# EAGLE board main_circuit (EAGLE 7.5.0), part 1 of 2
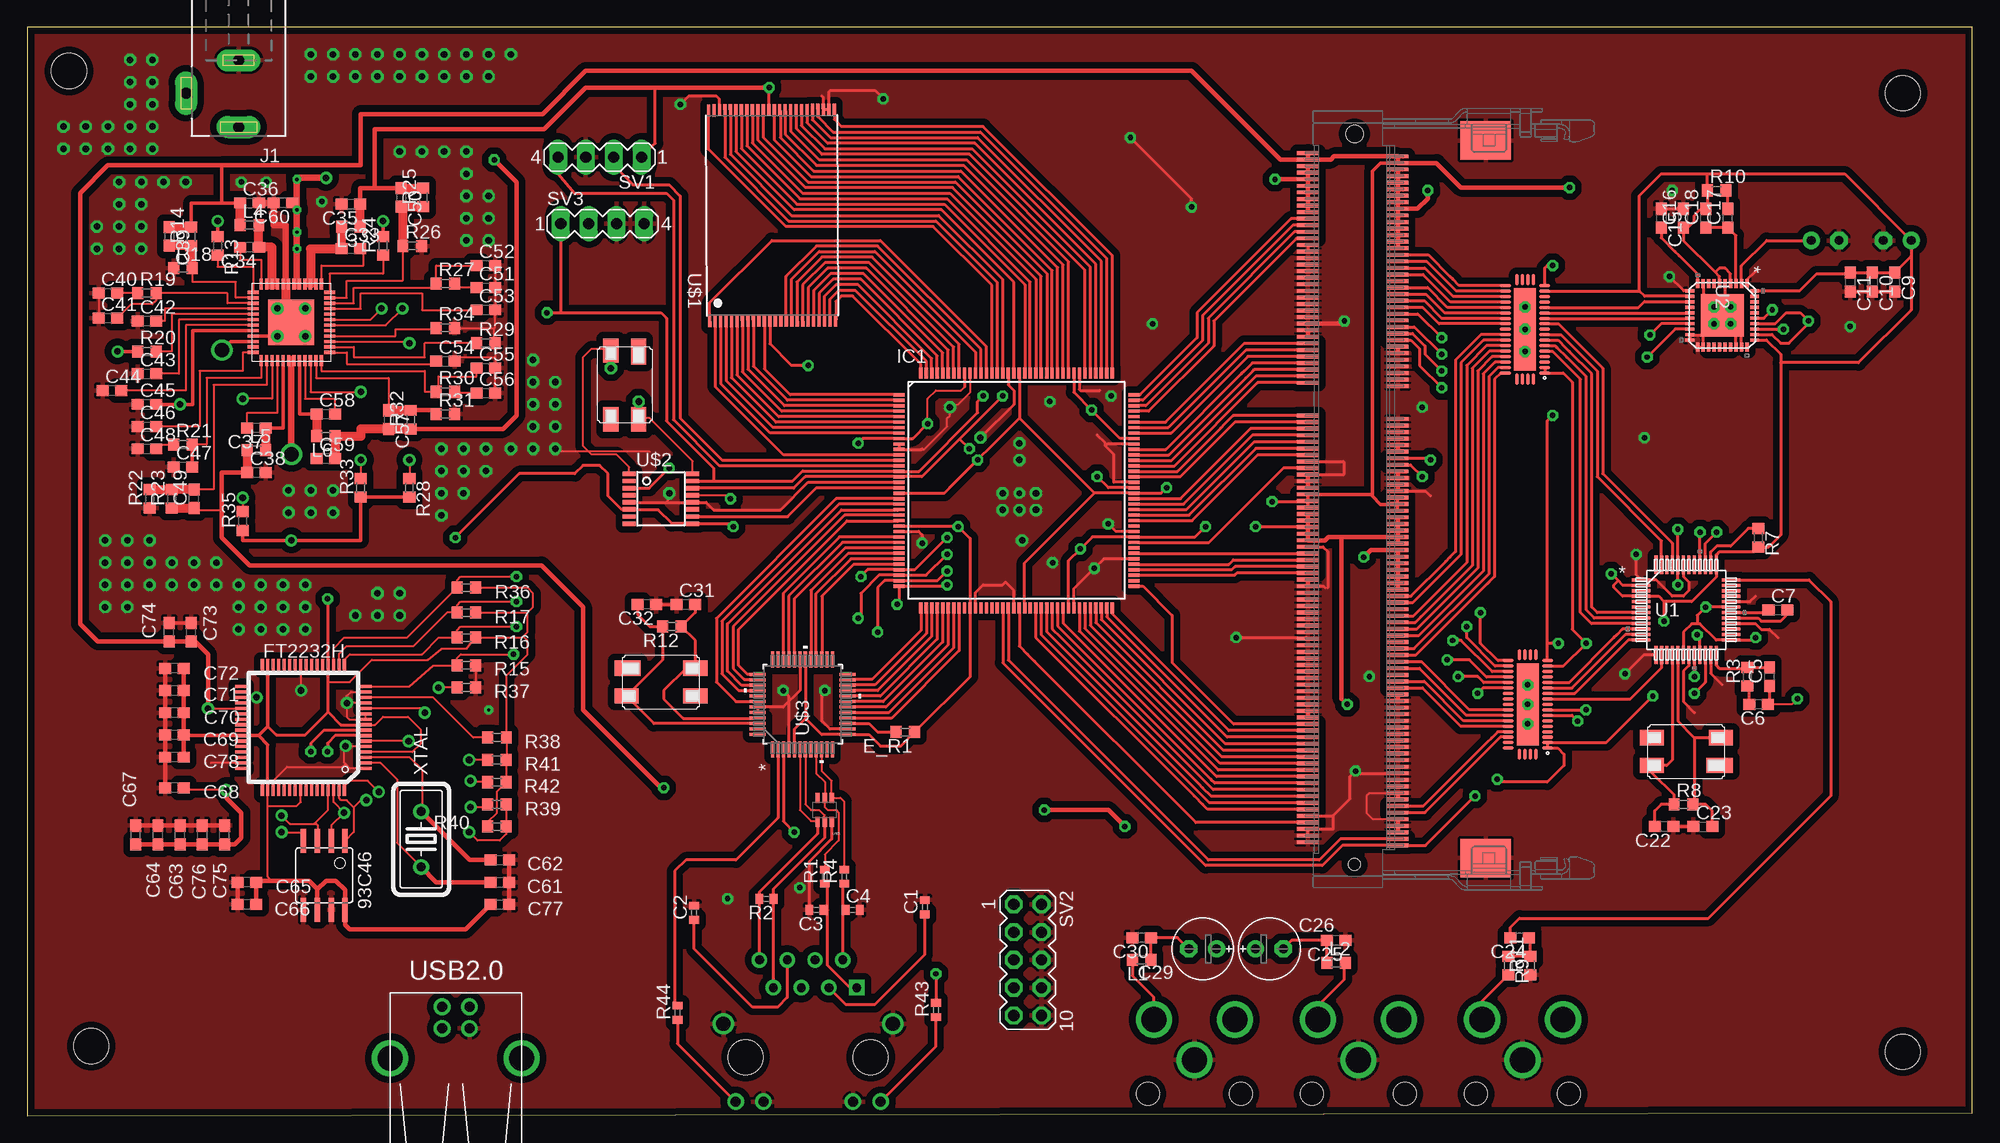
[diagram p5: board, top side]
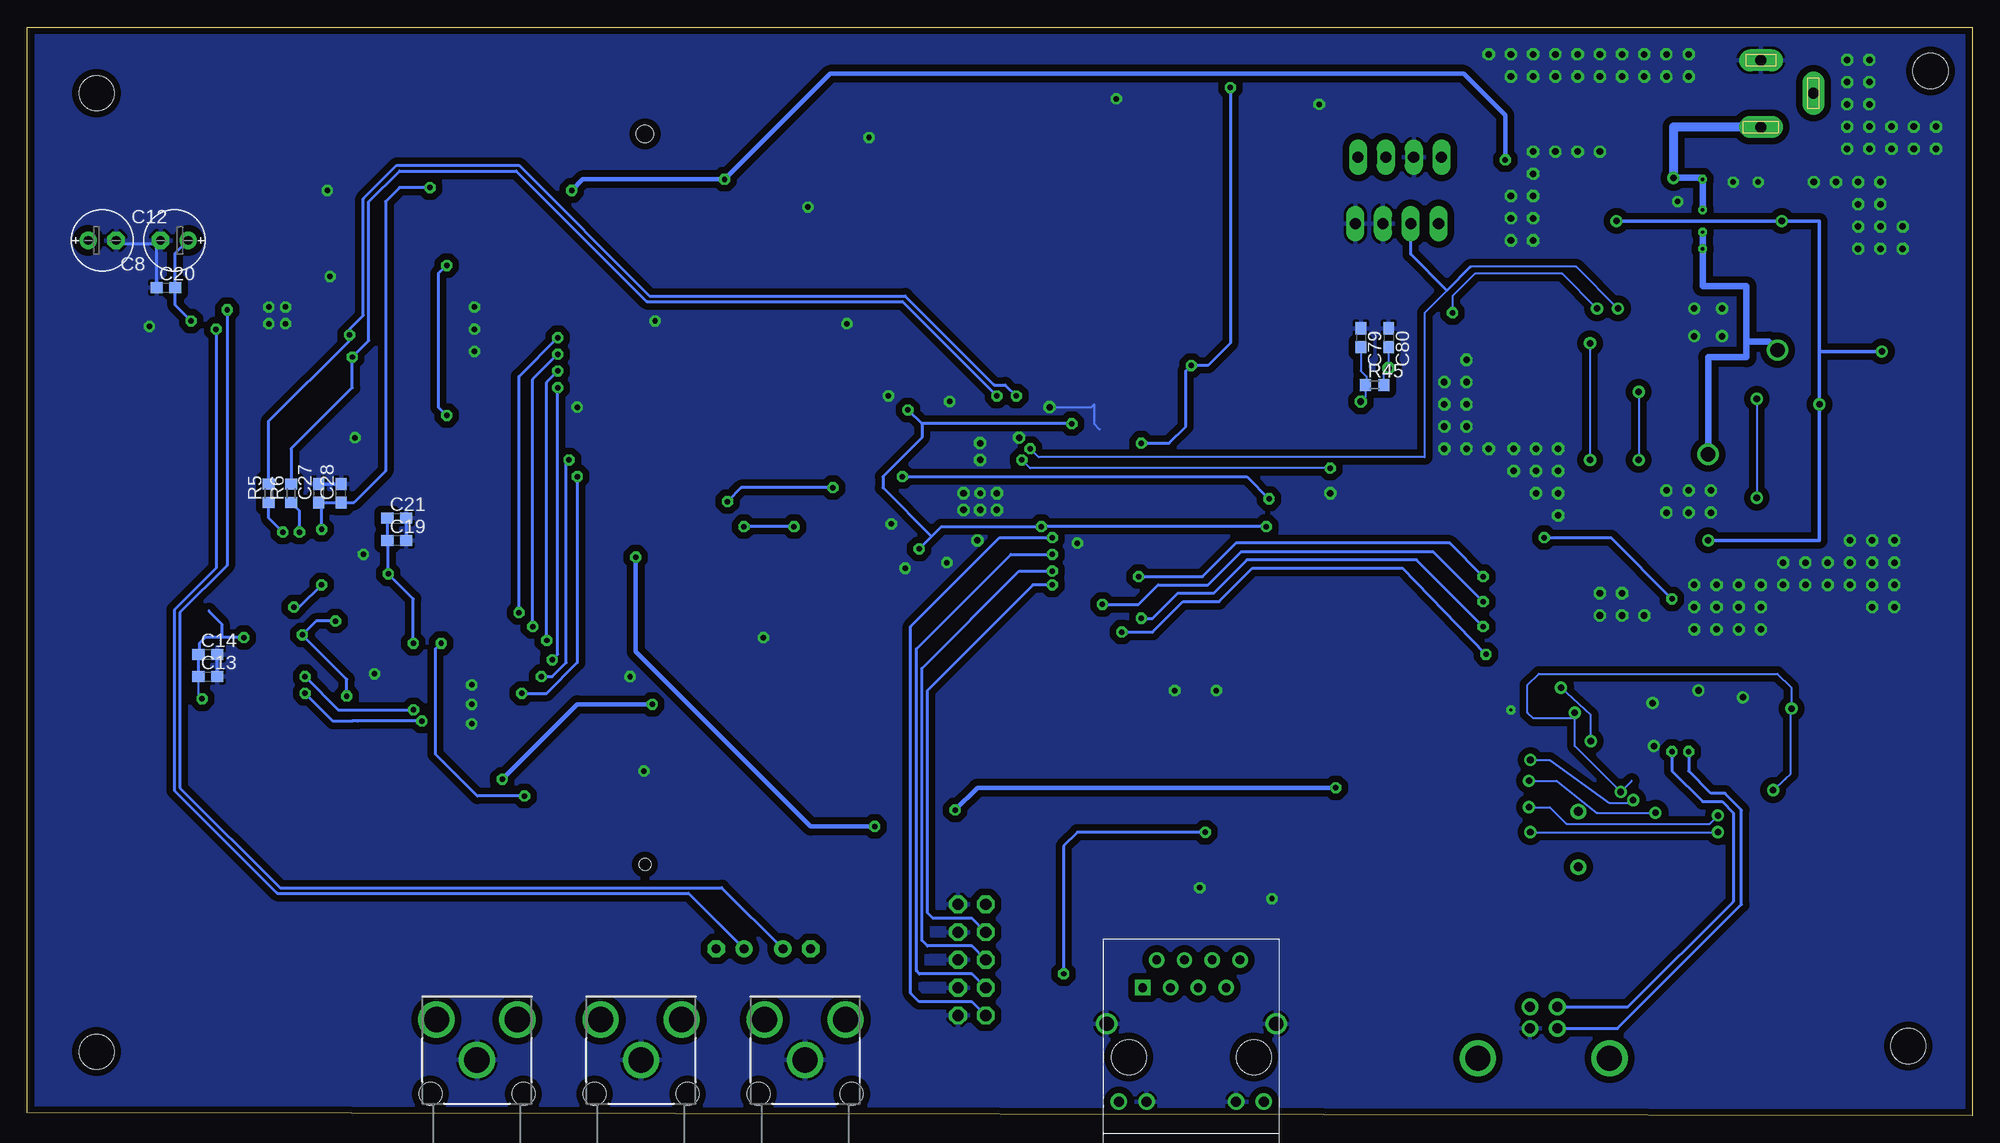
[diagram p6: board, bottom side, seen from below]

Size 177.78 x 99.49 mm. Coordinates in mm from the lower left corner, seen from the top.
Outline: 0,0 177.78,0.25 177.78,99.49 0,99.49 0,0
Copper layers (1*16): Top 0.035mm / dielectric 1.5mm / Bottom 0.035mm
Design rules "MayhewLabsPCB": minimum track width 6mil, minimum drill 12mil, track to track 6mil, track to pad 6mil, pad to pad 6mil, via to via 6mil, smd to smd 6mil, copper to edge 15mil, drill to drill 6mil, minimum pad ring 12mil, minimum via ring 10mil, stop-mask expansion 4mil, vias tented up to drill 25mil, thermal gap 10mil
Holes 3.2 mm at 3.81,95.5 5.84,6.35 171.45,5.84 171.45,93.47

## Footprints (pad centres in the part's own frame; a part is rotated, then mirrored left to right if it is on the bottom)
SOIC8 = smd 0.5 x 2.2: 1 -1.905,-3.154; 2 -0.645,-3.154; 3 0.625,-3.154; 4 1.895,-3.154; 5 1.905,3.154; 6 0.635,3.154; 7 -0.635,3.154; 8 -1.905,3.154
C0402 = smd 0.7 x 0.9: 1 -0.65,0; 2 0.65,0
C0603 = smd 1.1 x 1: 1 -0.85,0; 2 0.85,0
E2,5-6E = drill 0.813 pad 1.575: + -1.27,0 | drill 0.813 pad 1.575 octagon: - 1.27,0
R0603 = smd 1 x 1.1: 1 -0.85,0; 2 0.85,0
LQFP_NEW = smd 1.1 x 0.285: 1 -5.7,3.75; 2 -5.7,3.25; 3 -5.7,2.75; 4 -5.7,2.25; 5 -5.7,1.75; 6 -5.7,1.25; 7 -5.7,0.75; 8 -5.7,0.25; 9 -5.7,-0.25; 10 -5.7,-0.75; 11 -5.7,-1.25; 12 -5.7,-1.75; 13 -5.7,-2.25; 14 -5.7,-2.75; 15 -5.7,-3.25; 16 -5.7,-3.75; 33 5.7,-3.75; 34 5.7,-3.25; 35 5.7,-2.75; 36 5.7,-2.25; 37 5.7,-1.75; 38 5.7,-1.25; 39 5.7,-0.75; 40 5.7,-0.25; 41 5.7,0.25; 42 5.7,0.75; 43 5.7,1.25; 44 5.7,1.75; 45 5.7,2.25; 46 5.7,2.75; 47 5.7,3.25; 48 5.7,3.75 | smd 0.285 x 1.1: 17 -3.75,-5.7; 18 -3.25,-5.7; 19 -2.75,-5.7; 20 -2.25,-5.7; 21 -1.75,-5.7; 22 -1.25,-5.7; 23 -0.75,-5.7; 24 -0.25,-5.7; 25 0.25,-5.7; 26 0.75,-5.7; 27 1.25,-5.7; 28 1.75,-5.7; 29 2.25,-5.7; 30 2.75,-5.7; 31 3.25,-5.7; 32 3.75,-5.7; 49 3.75,5.7; 50 3.25,5.7; 51 2.75,5.7; 52 2.25,5.7; 53 1.75,5.7; 54 1.25,5.7; 55 0.75,5.7; 56 0.25,5.7; 57 -0.25,5.7; 58 -0.75,5.7; 59 -1.25,5.7; 60 -1.75,5.7; 61 -2.25,5.7; 62 -2.75,5.7; 63 -3.25,5.7; 64 -3.75,5.7
R-PWQFN-N42 = smd 7.5 x 2: GND@1 0,0 | smd 0.3 x 1: P$1 -4,-1.8; P$2 -3.5,-1.8; P$3 -3,-1.8; P$4 -2.5,-1.8; P$5 -2,-1.8; P$6 -1.5,-1.8; P$7 -1,-1.8; P$8 -0.5,-1.8; P$9 0,-1.8; P$10 0.5,-1.8; P$11 1,-1.8; P$12 1.5,-1.8; P$13 2,-1.8; P$14 2.5,-1.8; P$15 3,-1.8; P$16 3.5,-1.8; P$17 4,-1.8; P$22 4,1.8; P$23 3.5,1.8; P$24 3,1.8; P$25 2.5,1.8; P$26 2,1.8; P$27 1.5,1.8; P$28 1,1.8; P$29 0.5,1.8; P$30 0,1.8; P$31 -0.5,1.8; P$32 -1,1.8; P$33 -1.5,1.8; P$34 -2,1.8; P$35 -2.5,1.8; P$36 -3,1.8; P$37 -3.5,1.8; P$38 -4,1.8 | smd 1 x 0.3: P$18 4.55,-0.75; P$19 4.55,-0.25; P$20 4.55,0.25; P$21 4.55,0.75; P$39 -4.55,0.75; P$40 -4.55,0.25; P$41 -4.55,-0.25; P$42 -4.55,-0.75
TQFP144 = smd 1 x 0.3: 1 -10.75,8.75; 2 -10.75,8.25; 3 -10.75,7.75; 4 -10.75,7.25; 5 -10.75,6.75; 6 -10.75,6.25; 7 -10.75,5.75; 8 -10.75,5.25; 9 -10.75,4.75; 10 -10.75,4.25; 11 -10.75,3.75; 12 -10.75,3.25; 13 -10.75,2.75; 14 -10.75,2.25; 15 -10.75,1.75; 16 -10.75,1.25; 17 -10.75,0.75; 18 -10.75,0.25; 19 -10.75,-0.25; 20 -10.75,-0.75; 21 -10.75,-1.25; 22 -10.75,-1.75; 23 -10.75,-2.25; 24 -10.75,-2.75; 25 -10.75,-3.25; 26 -10.75,-3.75; 27 -10.75,-4.25; 28 -10.75,-4.75; 29 -10.75,-5.25; 30 -10.75,-5.75; 31 -10.75,-6.25; 32 -10.75,-6.75; 33 -10.75,-7.25; 34 -10.75,-7.75; 35 -10.75,-8.25; 36 -10.75,-8.75; 73 10.75,-8.75; 74 10.75,-8.25; 75 10.75,-7.75; 76 10.75,-7.25; 77 10.75,-6.75; 78 10.75,-6.25; 79 10.75,-5.75; 80 10.75,-5.25; 81 10.75,-4.75; 82 10.75,-4.25; 83 10.75,-3.75; 84 10.75,-3.25; 85 10.75,-2.75; 86 10.75,-2.25; 87 10.75,-1.75; 88 10.75,-1.25; 89 10.75,-0.75; 90 10.75,-0.25; 91 10.75,0.25; 92 10.75,0.75; 93 10.75,1.25; 94 10.75,1.75; 95 10.75,2.25; 96 10.75,2.75; 97 10.75,3.25; 98 10.75,3.75; 99 10.75,4.25; 100 10.75,4.75; 101 10.75,5.25; 102 10.75,5.75; 103 10.75,6.25; 104 10.75,6.75; 105 10.75,7.25; 106 10.75,7.75; 107 10.75,8.25; 108 10.75,8.75 | smd 0.3 x 1: 37 -8.75,-10.75; 38 -8.25,-10.75; 39 -7.75,-10.75; 40 -7.25,-10.75; 41 -6.75,-10.75; 42 -6.25,-10.75; 43 -5.75,-10.75; 44 -5.25,-10.75; 45 -4.75,-10.75; 46 -4.25,-10.75; 47 -3.75,-10.75; 48 -3.25,-10.75; 49 -2.75,-10.75; 50 -2.25,-10.75; 51 -1.75,-10.75; 52 -1.25,-10.75; 53 -0.75,-10.75; 54 -0.25,-10.75; 55 0.25,-10.75; 56 0.75,-10.75; 57 1.25,-10.75; 58 1.75,-10.75; 59 2.25,-10.75; 60 2.75,-10.75; 61 3.25,-10.75; 62 3.75,-10.75; 63 4.25,-10.75; 64 4.75,-10.75; 65 5.25,-10.75; 66 5.75,-10.75; 67 6.25,-10.75; 68 6.75,-10.75; 69 7.25,-10.75; 70 7.75,-10.75; 71 8.25,-10.75; 72 8.75,-10.75; 109 8.75,10.75; 110 8.25,10.75; 111 7.75,10.75; 112 7.25,10.75; 113 6.75,10.75; 114 6.25,10.75; 115 5.75,10.75; 116 5.25,10.75; 117 4.75,10.75; 118 4.25,10.75; 119 3.75,10.75; 120 3.25,10.75; 121 2.75,10.75; 122 2.25,10.75; 123 1.75,10.75; 124 1.25,10.75; 125 0.75,10.75; 126 0.25,10.75; 127 -0.25,10.75; 128 -0.75,10.75; 129 -1.25,10.75; 130 -1.75,10.75; 131 -2.25,10.75; 132 -2.75,10.75; 133 -3.25,10.75; 134 -3.75,10.75; 135 -4.25,10.75; 136 -4.75,10.75; 137 -5.25,10.75; 138 -5.75,10.75; 139 -6.25,10.75; 140 -6.75,10.75; 141 -7.25,10.75; 142 -7.75,10.75; 143 -8.25,10.75; 144 -8.75,10.75
DCJ0202 = drill 1 pad 2 long: 1 0,3.1; 2 4.8,0; 3 0,-3
R0402 = smd 0.7 x 0.9: 1 -0.65,0; 2 0.65,0
MA04-1 = drill 1.016 long: 1 -3.81,0; 2 -1.27,0; 3 1.27,0; 4 3.81,0
MA05-2 = drill 1.016 octagon: 1 -5.08,-1.27; 2 -5.08,1.27; 3 -2.54,-1.27; 4 -2.54,1.27; 5 0,-1.27; 6 0,1.27; 7 2.54,-1.27; 8 2.54,1.27; 9 5.08,-1.27; 10 5.08,1.27
ST_48 = smd 1.676 x 0.279: 1 -4.115,2.75; 2 -4.115,2.25; 3 -4.115,1.75; 4 -4.115,1.25; 5 -4.115,0.75; 6 -4.115,0.25; 7 -4.115,-0.25; 8 -4.115,-0.75; 9 -4.115,-1.25; 10 -4.115,-1.75; 11 -4.115,-2.25; 12 -4.115,-2.75; 25 4.115,-2.75; 26 4.115,-2.25; 27 4.115,-1.75; 28 4.115,-1.25; 29 4.115,-0.75; 30 4.115,-0.25; 31 4.115,0.25; 32 4.115,0.75; 33 4.115,1.25; 34 4.115,1.75; 35 4.115,2.25; 36 4.115,2.75 | smd 0.279 x 1.676: 13 -2.75,-4.115; 14 -2.25,-4.115; 15 -1.75,-4.115; 16 -1.25,-4.115; 17 -0.75,-4.115; 18 -0.25,-4.115; 19 0.25,-4.115; 20 0.75,-4.115; 21 1.25,-4.115; 22 1.75,-4.115; 23 2.25,-4.115; 24 2.75,-4.115; 37 2.75,4.115; 38 2.25,4.115; 39 1.75,4.115; 40 1.25,4.115; 41 0.75,4.115; 42 0.25,4.115; 43 -0.25,4.115; 44 -0.75,4.115; 45 -1.25,4.115; 46 -1.75,4.115; 47 -2.25,4.115; 48 -2.75,4.115
CP_40_14 = smd 0.813 x 0.305: 1 -2.902,2.25; 2 -2.902,1.75; 3 -2.902,1.25; 4 -2.902,0.75; 5 -2.902,0.25; 6 -2.902,-0.25; 7 -2.902,-0.75; 8 -2.902,-1.25; 9 -2.902,-1.75; 10 -2.902,-2.25; 21 2.902,-2.25; 22 2.902,-1.75; 23 2.902,-1.25; 24 2.902,-0.75; 25 2.902,-0.25; 26 2.902,0.25; 27 2.902,0.75; 28 2.902,1.25; 29 2.902,1.75; 30 2.902,2.25 | smd 0.305 x 0.813: 11 -2.25,-2.95; 12 -1.75,-2.95; 13 -1.25,-2.95; 14 -0.75,-2.95; 15 -0.25,-2.95; 16 0.25,-2.95; 17 0.75,-2.95; 18 1.25,-2.95; 19 1.75,-2.95; 20 2.25,-2.95; 31 2.25,2.95; 32 1.75,2.95; 33 1.25,2.95; 34 0.75,2.95; 35 0.25,2.95; 36 -0.25,2.95; 37 -0.75,2.95; 38 -1.25,2.95; 39 -1.75,2.95; 40 -2.25,2.95 | smd 3.912 x 3.912: 41 0,0
TSOP48 = smd 1.1 x 0.3: 1 -9.625,5.75; 2 -9.625,5.25; 3 -9.625,4.75; 4 -9.625,4.25; 5 -9.625,3.75; 6 -9.625,3.25; 7 -9.625,2.75; 8 -9.625,2.25; 9 -9.625,1.75; 10 -9.625,1.25; 11 -9.625,0.75; 12 -9.625,0.25; 13 -9.625,-0.25; 14 -9.625,-0.75; 15 -9.625,-1.25; 16 -9.625,-1.75; 17 -9.625,-2.25; 18 -9.625,-2.75; 19 -9.625,-3.25; 20 -9.625,-3.75; 21 -9.625,-4.25; 22 -9.625,-4.75; 23 -9.625,-5.25; 24 -9.625,-5.75; 25 9.625,-5.75; 26 9.625,-5.25; 27 9.625,-4.75; 28 9.625,-4.25; 29 9.625,-3.75; 30 9.625,-3.25; 31 9.625,-2.75; 32 9.625,-2.25; 33 9.625,-1.75; 34 9.625,-1.25; 35 9.625,-0.75; 36 9.625,-0.25; 37 9.625,0.25; 38 9.625,0.75; 39 9.625,1.25; 40 9.625,1.75; 41 9.625,2.25; 42 9.625,2.75; 43 9.625,3.25; 44 9.625,3.75; 45 9.625,4.25; 46 9.625,4.75; 47 9.625,5.25; 48 9.625,5.75
R-PDSO-G16 = smd 0.4 x 1.2: 1 -2.275,-2.9; 2 -1.625,-2.9; 3 -0.975,-2.9; 4 -0.325,-2.9; 5 0.325,-2.9; 6 0.975,-2.9; 7 1.625,-2.9; 8 2.275,-2.9; 9 2.275,2.9; 10 1.625,2.9; 11 0.975,2.9; 12 0.325,2.9; 13 -0.325,2.9; 14 -0.975,2.9; 15 -1.625,2.9; 16 -2.275,2.9
QFP48-7X7-0P5MM = smd 1.473 x 0.279: 1 -4.115,2.75; 2 -4.115,2.25; 3 -4.115,1.75; 4 -4.115,1.25; 5 -4.115,0.75; 6 -4.115,0.25; 7 -4.115,-0.25; 8 -4.115,-0.75; 9 -4.115,-1.25; 10 -4.115,-1.75; 11 -4.115,-2.25; 12 -4.115,-2.75; 25 4.115,-2.75; 26 4.115,-2.25; 27 4.115,-1.75; 28 4.115,-1.25; 29 4.115,-0.75; 30 4.115,-0.25; 31 4.115,0.25; 32 4.115,0.75; 33 4.115,1.25; 34 4.115,1.75; 35 4.115,2.25; 36 4.115,2.75 | smd 0.279 x 1.473: 13 -2.75,-4.115; 14 -2.25,-4.115; 15 -1.75,-4.115; 16 -1.25,-4.115; 17 -0.75,-4.115; 18 -0.25,-4.115; 19 0.25,-4.115; 20 0.75,-4.115; 21 1.25,-4.115; 22 1.75,-4.115; 23 2.25,-4.115; 24 2.75,-4.115; 37 2.75,4.115; 38 2.25,4.115; 39 1.75,4.115; 40 1.25,4.115; 41 0.75,4.115; 42 0.25,4.115; 43 -0.25,4.115; 44 -0.75,4.115; 45 -1.25,4.115; 46 -1.75,4.115; 47 -2.25,4.115; 48 -2.75,4.115
SODIMM_DDR3_CONN = smd 0.35 x 2: 1 26.018,4.348; 2 25.719,-3.855; 3 25.419,4.345; 4 25.119,-3.855; 5 24.819,4.345; 6 24.519,-3.855; 7 24.219,4.345; 8 23.919,-3.855; 9 23.619,4.345; 10 23.319,-3.855; 11 23.019,4.345; 12 22.719,-3.855; 13 22.419,4.345; 14 22.119,-3.855; 15 21.819,4.345; 16 21.519,-3.855; 17 21.219,4.345; 18 20.919,-3.855; 19 20.619,4.345; 20 20.319,-3.855; 21 20.019,4.345; 22 19.719,-3.855; 23 19.419,4.345; 24 19.119,-3.855; 25 18.819,4.345; 26 18.519,-3.855; 27 18.219,4.345; 28 17.919,-3.855; 29 17.619,4.345; 30 17.319,-3.855; 31 17.019,4.345; 32 16.719,-3.855; 33 16.419,4.345; 34 16.119,-3.855; 35 15.819,4.345; 36 15.519,-3.855; 37 15.219,4.345; 38 14.919,-3.855; 39 14.619,4.345; 40 14.319,-3.855; 41 14.019,4.345; 42 13.719,-3.855; 43 13.419,4.345; 44 13.119,-3.855; 45 12.819,4.345; 46 12.519,-3.855; 47 12.219,4.345; 48 11.919,-3.855; 49 11.619,4.345; 50 11.319,-3.855; 51 11.019,4.345; 52 10.719,-3.855; 53 10.419,4.345; 54 10.119,-3.855; 55 9.819,4.345; 56 9.519,-3.855; 57 9.219,4.345; 58 8.919,-3.855; 59 8.619,4.345; 60 8.319,-3.855; 61 8.019,4.345; 62 7.719,-3.855; 63 7.419,4.345; 64 7.119,-3.855; 65 6.819,4.345; 66 6.519,-3.855; 67 6.219,4.345; 68 5.919,-3.855; 69 5.619,4.345; 70 5.319,-3.855; 71 5.019,4.345; 72 4.719,-3.855; 73 2.019,4.345; 74 1.719,-3.855; 75 1.419,4.345; 76 1.119,-3.855; 77 0.819,4.345; 78 0.519,-3.855; 79 0.219,4.345; 80 -0.081,-3.855; 81 -0.381,4.345; 82 -0.681,-3.855; 83 -0.981,4.345; 84 -1.281,-3.855; 85 -1.581,4.345; 86 -1.881,-3.855; 87 -2.181,4.345; 88 -2.481,-3.855; 89 -2.781,4.345; 90 -3.081,-3.855; 91 -3.381,4.345; 92 -3.681,-3.855; 93 -3.981,4.345; 94 -4.281,-3.855; 95 -4.581,4.345; 96 -4.881,-3.855; 97 -5.181,4.345; 98 -5.481,-3.855; 99 -5.781,4.345; 100 -6.081,-3.855; 101 -6.381,4.345; 102 -6.681,-3.855; 103 -6.981,4.345; 104 -7.281,-3.855; 105 -7.581,4.345; 106 -7.881,-3.855; 107 -8.181,4.345; 108 -8.481,-3.855; 109 -8.781,4.345; 110 -9.081,-3.855; 111 -9.381,4.345; 112 -9.681,-3.855; 113 -9.981,4.345; 114 -10.281,-3.855; 115 -10.581,4.345; 116 -10.881,-3.855; 117 -11.181,4.345; 118 -11.481,-3.855; 119 -11.781,4.345; 120 -12.081,-3.855; 121 -12.381,4.345; 122 -12.681,-3.855; 123 -12.981,4.345; 124 -13.281,-3.855; 125 -13.581,4.345; 126 -13.881,-3.855; 127 -14.181,4.345; 128 -14.481,-3.855; 129 -14.781,4.345; 130 -15.081,-3.855; 131 -15.381,4.345; 132 -15.681,-3.855; 133 -15.981,4.345; 134 -16.281,-3.855; 135 -16.581,4.345; 136 -16.881,-3.855; 137 -17.181,4.345; 138 -17.481,-3.855; 139 -17.781,4.345; 140 -18.081,-3.855; 141 -18.381,4.345; 142 -18.681,-3.855; 143 -18.981,4.345; 144 -19.281,-3.855; 145 -19.581,4.345; 146 -19.881,-3.855; 147 -20.181,4.345; 148 -20.481,-3.855; 149 -20.781,4.345; 150 -21.081,-3.855; 151 -21.381,4.345; 152 -21.681,-3.855; 153 -21.981,4.345; 154 -22.281,-3.855; 155 -22.581,4.345; 156 -22.881,-3.855; 157 -23.181,4.345; 158 -23.481,-3.855; 159 -23.781,4.345; 160 -24.081,-3.855; 161 -24.381,4.345; 162 -24.681,-3.855; 163 -24.981,4.345; 164 -25.281,-3.855; 165 -25.581,4.345; 166 -25.881,-3.855; 167 -26.181,4.345; 168 -26.481,-3.855; 169 -26.781,4.345; 170 -27.081,-3.855; 171 -27.381,4.345; 172 -27.681,-3.855; 173 -27.981,4.345; 174 -28.281,-3.855; 175 -28.581,4.345; 176 -28.881,-3.855; 177 -29.181,4.345; 178 -29.481,-3.855; 179 -29.781,4.345; 180 -30.081,-3.855; 181 -30.381,4.345; 182 -30.681,-3.855; 183 -30.981,4.345; 184 -31.281,-3.855; 185 -31.581,4.345; 186 -31.881,-3.855; 187 -32.181,4.345; 188 -32.481,-3.855; 189 -32.781,4.345; 190 -33.081,-3.855; 191 -33.381,4.345; 192 -33.681,-3.855; 193 -33.981,4.345; 194 -34.281,-3.855; 195 -34.581,4.345; 196 -34.881,-3.855; 197 -35.181,4.345; 198 -35.481,-3.855; 199 -35.781,4.345; 200 -36.081,-3.855; 201 -36.381,4.345; 202 -36.681,-3.855; 203 -36.981,4.345; 204 -37.281,-3.855 | smd 3.5 x 4.6: GND_PAD1 27.17,-11.9; GND_PAD2 -38.43,-11.9 | hole 1.6: 27.772,0.093 | hole 1.1: -39.028,0.093
SC70-6 = smd 0.4 x 0.9: 1 -0.665,-1.097; 2 -0.015,-1.096; 3 0.635,-1.097; 4 0.635,1.103; 5 -0.015,1.104; 6 -0.665,1.103
MAGJACK = drill 0.8 square: 1 -4.445,6.35 | drill 0.8: 2 -3.175,8.89; 3 -1.905,6.35; 4 -0.635,8.89; 5 0.635,6.35; 6 1.905,8.89; 7 3.175,6.35; 8 4.445,8.89 | drill 1.3: GND1 -7.747,3.048; GND2 7.747,3.048 | drill 0.9: LED1.1 -6.629,-4.064; LED1.2 -4.089,-4.064; LED2.1 4.089,-4.064; LED2.2 6.629,-4.064 | hole 3.2: -5.715,0; 5.715,0
AV3RCA = drill 2.3: PIN -0.11,-7.51; PIN1 14.89,-7.51; PIN2 29.89,-7.51; SHELL -3.81,-3.81; SHELL1 11.19,-3.81; SHELL2 26.19,-3.81; SWITCH -7.51,-7.51; SWITCH1 7.49,-7.51; SWITCH2 22.49,-7.51 | hole 2.1: 0.44,-0.71; -8.06,-0.71; 15.44,-0.71; 6.94,-0.71; 30.44,-0.71; 21.94,-0.71
VQFN48 = smd 4.2 x 4.2: 0 0,0 | smd 1 x 0.3: 1 -3.5,2.75; 2 -3.5,2.25; 3 -3.5,1.75; 4 -3.5,1.25; 5 -3.5,0.75; 6 -3.5,0.25; 7 -3.5,-0.25; 8 -3.5,-0.75; 9 -3.5,-1.25; 10 -3.5,-1.75; 11 -3.5,-2.25; 12 -3.5,-2.75; 25 3.5,-2.75; 26 3.5,-2.25; 27 3.5,-1.75; 28 3.5,-1.25; 29 3.5,-0.75; 30 3.5,-0.25; 31 3.5,0.25; 32 3.5,0.75; 33 3.5,1.25; 34 3.5,1.75; 35 3.5,2.25; 36 3.5,2.75 | smd 0.3 x 1: 13 -2.75,-3.5; 14 -2.25,-3.5; 15 -1.75,-3.5; 16 -1.25,-3.5; 17 -0.75,-3.5; 18 -0.25,-3.5; 19 0.25,-3.5; 20 0.75,-3.5; 21 1.25,-3.5; 22 1.75,-3.5; 23 2.25,-3.5; 24 2.75,-3.5; 37 2.75,3.5; 38 2.25,3.5; 39 1.75,3.5; 40 1.25,3.5; 41 0.75,3.5; 42 0.25,3.5; 43 -0.25,3.5; 44 -0.75,3.5; 45 -1.25,3.5; 46 -1.75,3.5; 47 -2.25,3.5; 48 -2.75,3.5
USB-B-H = drill 0.914: D+ 0,1.25; D- 1.981,1.25; GND 0,-1.25; VBUS 1.981,-1.25 | drill 2.286: P$1 -2.718,-6.02; P$2 -2.718,6.02
HC18U-V = drill 0.813: 1 -2.54,0; 2 2.54,0
7X5MM = smd 2.2 x 1.4: 1 -3.15,-1.27; 2 -3.15,1.27; 3 3.15,1.27 | smd 2.4 x 1.4: 4 3.05,-1.27

## Placement (x,y rotation side)
93C46  [SOIC8]  27.14,21.97 180 top
C1  0.1uF  [C0402]  82.04,19.05 90 top
C2  0.1uF  [C0402]  60.96,18.54 90 top
C3  0.001uF  [C0402]  72.14,18.8 180 top
C4  0.001uF  [C0402]  75.44,18.8 0 top
C5  10nF  [C0603]  159.26,40.13 90 top
C6  82nF  [C0603]  158.24,37.59 180 top
C7  0.1uF  [C0603]  160.02,46.23 0 top
C8  10uF  [E2,5-6E]  164.34,80.01 180 bottom
C9  0.1uF  [C0603]  170.69,76.2 270 top
C10  0.1uF  [C0603]  168.66,76.2 270 top
C11  0.1uF  [C0603]  166.62,76.2 270 top
C12  10uF  [E2,5-6E]  170.94,80.01 0 bottom
C13  0.1uF  [C0603]  161.29,40.13 0 bottom
C14  10nF  [C0603]  161.29,42.16 0 bottom
C15  0.1uF  [C0603]  149.35,82.04 270 top
C16  0.1uF  [C0603]  151.38,82.04 90 top
C17  CALCU  [C0603]  155.45,82.04 90 top
C18  CALCU  [C0603]  153.42,82.04 90 top
C19  0.1uF  [C0603]  144.02,52.58 0 bottom
C20  0.1uF  [C0603]  165.1,75.69 0 bottom
C21  10nF  [C0603]  144.02,54.61 0 bottom
C22  47pf  [C0603]  149.61,26.42 180 top
C23  47pf  [C0603]  153.16,26.42 0 top
C24  0.1uF  [C0603]  136.4,16.26 180 top
C25  0.1uF  [C0603]  119.63,16 180 top
C26  10uF  [E2,5-6E]  113.54,15.24 0 top
C27  0.1uF  [C0603]  151.13,56.9 90 bottom
C28  10nF  [C0603]  149.1,56.9 90 bottom
C29  10uF  [E2,5-6E]  107.44,15.24 180 top
C30  0.1uF  [C0603]  101.85,16.26 180 top
C31  47pf  [C0603]  60.2,46.74 0 top
C32  47pf  [C0603]  56.64,46.74 180 top
C33  [C0603]  29.59,79.25 0 top
C34  [C0603]  20.32,79.38 180 top
C35  [C0603]  29.59,83.31 180 top
C36  [C0603]  20.32,83.44 0 top
C37  [C0603]  20.96,62.87 180 top
C38  [C0603]  20.96,58.8 0 top
C39  [C0603]  12.95,80.39 270 top
C40  [C0603]  7.37,75.18 0 top
C41  [C0603]  7.37,72.9 0 top
C42  [C0603]  10.92,72.64 0 top
C43  10 uF  [C0603]  10.92,67.82 0 top
C44  4.7 uF  [C0603]  7.75,66.29 0 top
C45  3.3 uF  [C0603]  10.92,65.02 0 top
C46  [C0603]  10.92,62.99 0 top
C47  [C0603]  14.22,59.31 0 top
C48  [C0603]  10.92,60.96 0 top
C49  [C0603]  15.24,56.39 90 top
C50  [C0603]  34.16,83.95 270 top
C51  [C0603]  41.91,75.69 0 top
C52  [C0603]  41.91,77.72 0 top
C53  [C0603]  41.91,73.66 0 top
C54  [C0603]  38.23,68.96 0 top
C55  [C0603]  41.91,68.33 0 top
C56  [C0603]  41.91,66.04 0 top
C57  [C0603]  33.02,63.63 270 top
C58  [C0603]  27.3,64.14 0 top
C59  [C0603]  27.3,60.07 0 top
C60  [C0603]  23.37,83.44 180 top
C61  27pf  [C0603]  43.18,21.34 0 top
C62  27pf  [C0603]  43.18,23.37 0 top
C63  3.3uf  [C0603]  13.97,25.65 90 top
C64  3.3uf  [C0603]  11.94,25.65 90 top
C65  4.7uf  [C0603]  20.07,21.34 180 top
C66  4.7uf  [C0603]  20.07,19.3 180 top
C67  4.7uf  [C0603]  9.91,25.65 90 top
C68  4.7uf  [C0603]  13.46,29.97 180 top
C69  100nf  [C0603]  13.46,34.8 180 top
C70  100nf  [C0603]  13.46,36.83 180 top
C71  100nf  [C0603]  13.46,38.86 180 top
C72  100nf  [C0603]  13.46,40.89 180 top
C73  100nf  [C0603]  14.99,44.2 90 top
C74  100nf  [C0603]  12.95,44.2 90 top
C75  100nf  [C0603]  18.03,25.65 90 top
C76  100nf  [C0603]  16,25.65 90 top
C77  3.3uf  [C0603]  43.18,19.3 0 top
C78  3.3uf  [C0603]  13.46,32.77 180 top
C79  47pf  [C0603]  55.88,71.12 270 bottom
C80  47pf  [C0603]  53.34,71.12 270 bottom
E_R1  4.7k  [R0603]  80.26,35.05 180 top
FT2232H  FT2232H  [LQFP_NEW]  25.24,35.48 180 top
GND  TS3DV642  [R-PWQFN-N42]  136.91,71.88 90 top
IC1  5M1270ZT144  [TQFP144]  90.42,57.15 0 top
J1  DCJ0202  [DCJ0202]  19.3,93.47 180 top
L1  600Z  [R0603]  101.85,14.22 180 top
L2  600Z  [R0603]  119.63,13.97 0 top
L3  [R0603]  29.59,81.28 180 top
L4  [R0603]  20.32,81.41 0 top
L5  [R0603]  20.96,60.83 0 top
L6  [R0603]  27.3,62.1 180 top
R1  8E  [R0402]  72.9,21.84 90 top
R2  100E  [R0402]  67.56,19.81 180 top
R3  1.69k  [R0603]  157.23,40.13 90 top
R4  8E  [R0402]  74.68,21.84 90 top
R5  33E  [R0603]  155.7,56.9 90 bottom
R6  33E  [R0603]  153.67,56.9 90 bottom
R7  4K  [R0603]  158.24,52.83 270 top
R8  1M  [R0603]  151.38,28.45 0 top
R9  36  [R0603]  135.38,13.72 270 top
R10  CALCU  [R0603]  154.43,84.58 0 top
R11  39  [R0603]  137.41,13.72 90 top
R12  1M  [R0603]  58.93,44.7 180 top
R13  [R0603]  17.4,79.5 270 top
R14  [R0603]  14.99,80.39 90 top
R15  1k  [R0603]  40.15,41.16 0 top
R16  10k  [R0603]  40.13,43.69 0 top
R17  10k  [R0603]  40.13,45.97 0 top
R18  [R0603]  14.22,77.47 0 top
R19  [R0603]  10.92,75.18 0 top
R20  500  [R0603]  10.92,69.85 0 top
R21  [R0603]  14.22,61.34 0 top
R22  [R0603]  11.18,56.39 90 top
R23  [R0603]  13.21,56.39 90 top
R24  [R0603]  32.51,79.5 90 top
R25  [R0603]  36.2,83.95 90 top
R26  [R0603]  35.18,79.5 0 top
R27  [R0603]  38.23,76.07 0 top
R28  [R0603]  34.93,57.4 270 top
R29  85  [R0603]  41.91,70.61 0 top
R30  [R0603]  38.23,66.17 0 top
R31  [R0603]  38.23,64.14 0 top
R32  [R0603]  35.05,63.63 90 top
R33  [R0603]  30.48,57.4 90 top
R34  [R0603]  38.23,72.01 0 top
R35  [R0603]  19.69,54.36 90 top
R36  10k  [R0603]  40.13,48.26 0 top
R37  12k  [R0603]  40.15,39.13 180 top
R38  1k  [R0603]  42.94,34.56 180 top
R39  2.2k  [R0603]  42.93,28.45 180 top
R40  10k  [R0603]  42.93,26.42 180 top
R41  10k  [R0603]  42.93,32.51 0 top
R42  10k  [R0603]  42.93,30.48 0 top
R43  8E  [R0402]  83.06,9.65 90 top
R44  8E  [R0402]  59.44,9.4 90 top
R45  1M  [R0603]  54.61,66.8 0 bottom
SV1  [MA04-1]  52.32,87.63 180 top
SV2  [MA05-2]  91.44,14.22 270 top
SV3  [MA04-1]  52.58,81.53 0 top
U1  ADV7180BST48Z  [ST_48]  151.64,46.23 0 top
U2  ADAU1977WBCPZ  [CP_40_14]  154.94,73.15 270 top
U$1  SST39VF64  [TSOP48]  68.07,82.3 90.3 top
U$2  CDCE925  [R-PDSO-G16]  57.91,56.39 270 top
U$3  CP2200  [QFP48-7X7-0P5MM]  70.87,37.59 90 top
U$4  SODIMM  [SODIMM_DDR3_CONN]  121.41,61.98 90 top
U$5  TPD4E1B06DCKR  [SC70-6]  72.9,27.94 0 top
U$6  MAGJACK  [MAGJACK]  71.37,5.33 0 bottom
U$8  TS3DV642  [R-PWQFN-N42]  137.16,37.59 90 top
U$9  AV3RCA  [AV3RCA]  110.49,1.27 180 bottom
U$10  TPS65400RGZR  [VQFN48]  24.13,72.52 270 top
USB2.0  [USB-B-H]  39.16,7.96 90 top
XTAL  16MHz  [HC18U-V]  36,25.26 270 top
Y1  CRYSTAL.7X5MM  [7X5MM]  151.64,33.27 0 top
Y2  CRYSTAL.7X5MM  [7X5MM]  57.91,39.62 180 top
Y3  CRYSTAL.7X5MM  [7X5MM]  54.61,66.8 90 top